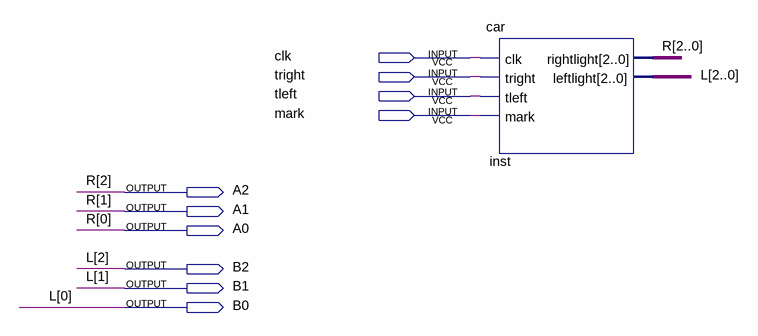
[diagram p0: schematic sheet]
// Quartus schematic car.bdf as structural Verilog: 1 symbols, 10 pins
module car (
  input  clk,
  input  tright,
  input  tleft,
  input  mark,
  output A2,
  output A1,
  output A0,
  output B2,
  output B1,
  output B0
);

  car inst (
    .clk(clk), .tright(tright), .tleft(tleft), .mark(mark), .rightlight({A2, A1, A0}),
    .leftlight({B2, B1, B0}));

  // Other names for the same wires on the sheet: L[2:0] = {B2, B1, B0}; R[2:0] = {A2, A1, A0}
endmodule
